# EAGLE schematic Mug Temperature Sensor (EAGLE 5.11)
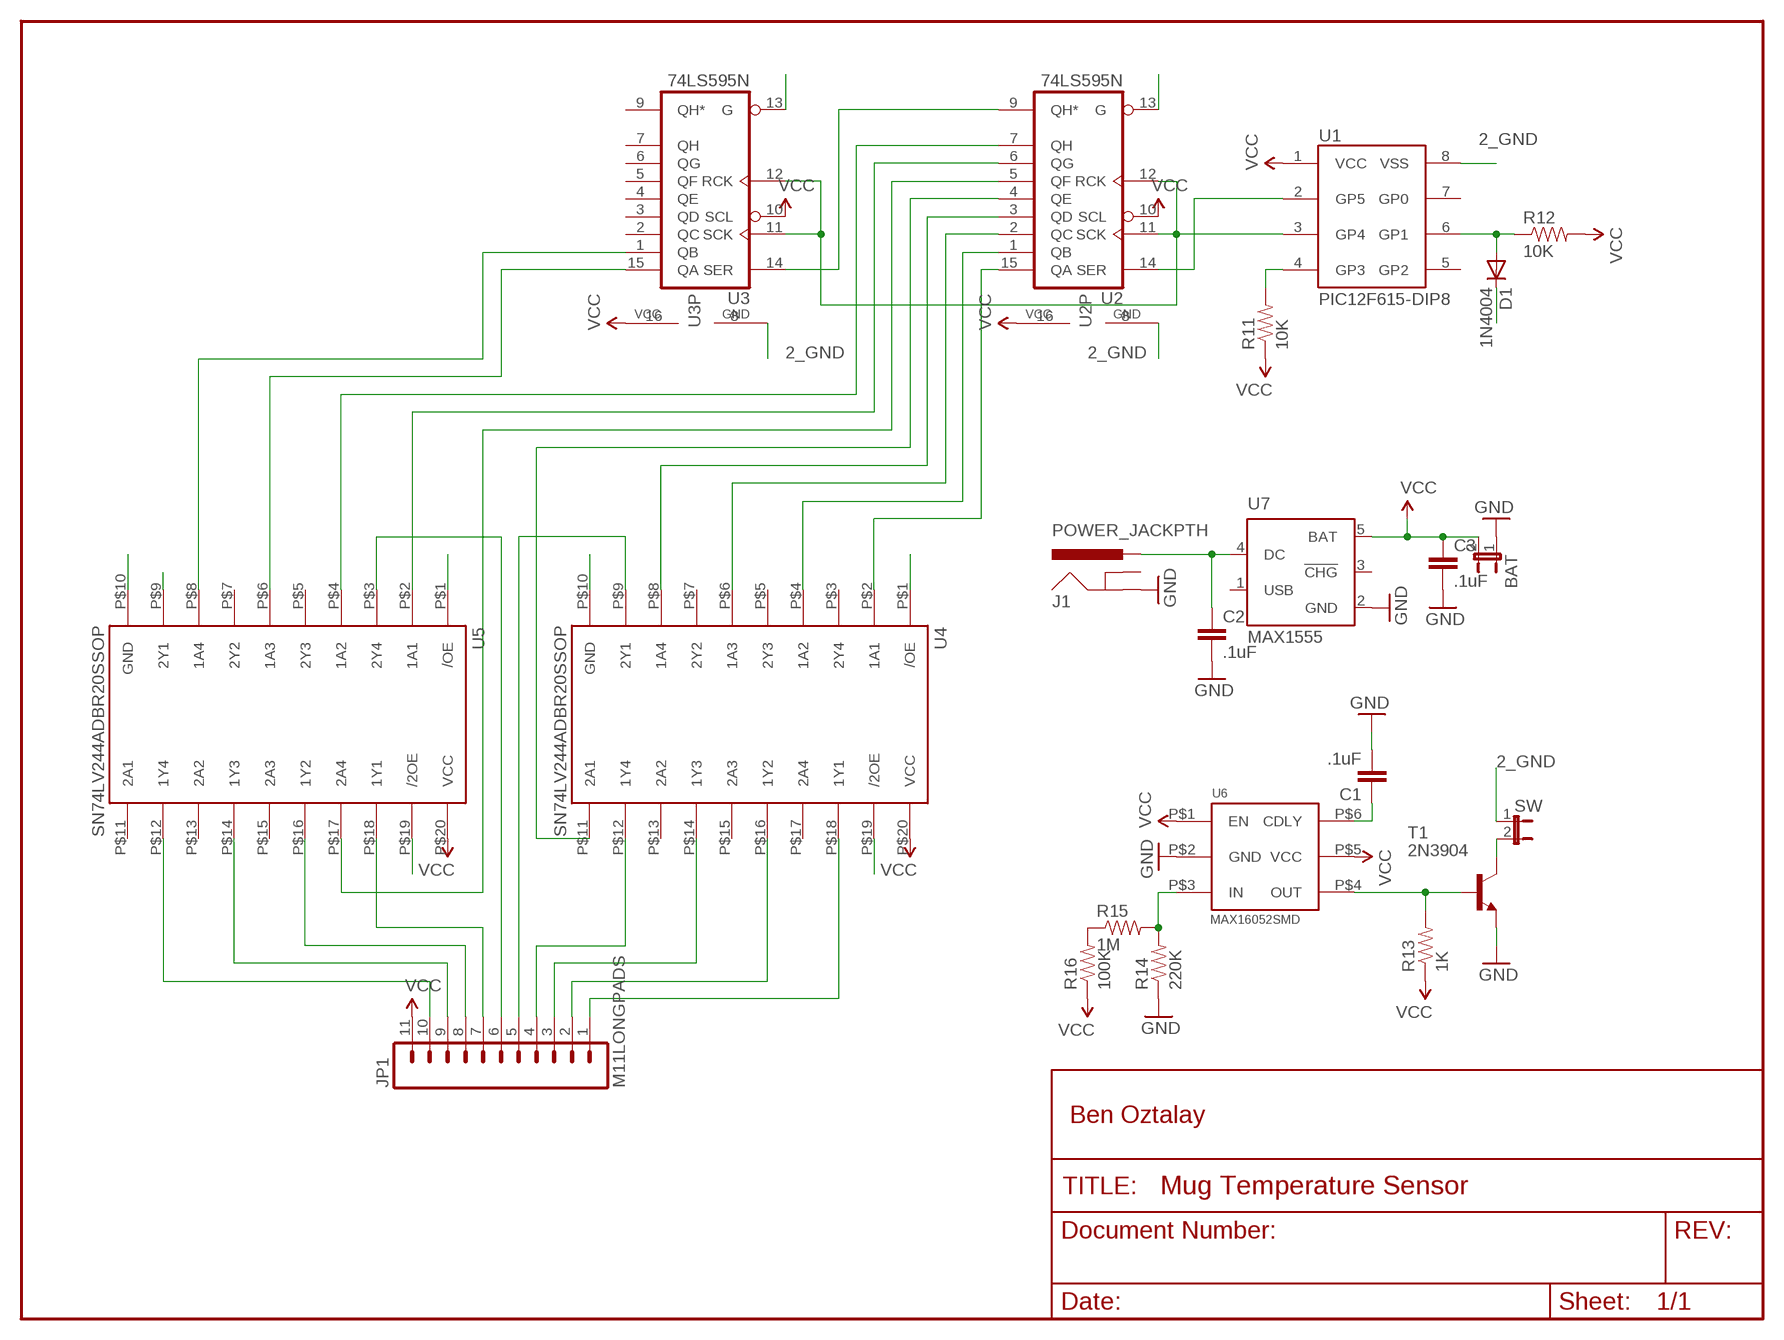
[diagram p0: schematic, sheet 1]

## Parts
BAT  JUMPER-2PTH  [1X02]
C1  .1uF  CAPPTH  [CAP-PTH-SMALL]
C2  .1uF  CAPPTH  [CAP-PTH-SMALL]
C3  .1uF  CAPPTH  [CAP-PTH-SMALL]
D1  1N4004  [DO41-10]
J1  POWER_JACKPTH  [POWER_JACK_PTH]
JP1  M11LONGPADS  [1X11_LONGPADS]
R11  10K  RESISTORPTH-1/4W  [AXIAL-0.4]
R12  10K  RESISTORPTH-1/4W  [AXIAL-0.4]
R13  1K  RESISTORPTH-1/4W  [AXIAL-0.4]
R14  220K  RESISTORPTH-1/4W  [AXIAL-0.4]
R15  1M  RESISTORPTH-1/4W  [AXIAL-0.4]
R16  100K  RESISTORPTH-1/4W  [AXIAL-0.4]
SW  JUMPER-2PTH  [1X02]
T1  2N3904  [TO92]
U1  PIC12F615-DIP8  [DIP-8-300]
U2  74LS595N  [DIL16]
U3  74LS595N  [DIL16]
U4  SN74LV244ADBR20SSOP  [20-SSOP]
U5  SN74LV244ADBR20SSOP  [20-SSOP]
U6  MAX16052SMD  [6-SOT23]
U7  MAX1555  [SOT23-5L]

## Nets
2_GND: D1.C SW.1 U1.8(VSS) U2.8(GND) U2.13(G) U3.8(GND) U3.13(G) U4.P$1(/OE) U4.P$10(GND) U4.P$19(/2OE) U5.P$10(GND) U5.P$19(/2OE)
GND: BAT.1 C1.2 C2.2 C3.2 J1.GND R14.P$1 T1.3(E) U6.P$2(GND) U7.2(GND)
N$1: U1.3(GP4) U2.11(SCK) U2.12(RCK) U3.11(SCK) U3.12(RCK)
N$2: U1.2(GP5) U2.14(SER)
N$3: U2.9(QH*) U3.14(SER)
N$6: JP1.10 U5.P$12(1Y4)
N$7: JP1.9 U5.P$14(1Y3)
N$8: JP1.8 U5.P$16(1Y2)
N$9: U5.P$9(2Y1)
N$10: JP1.7 U5.P$18(1Y1)
N$11: JP1.6 U5.P$3(2Y4)
N$12: U2.5(QF) U5.P$17(2A4)
N$13: U3.15(QA) U5.P$6(1A3)
N$14: U2.6(QG) U5.P$2(1A1)
N$16: U2.4(QE) U4.P$11(2A1)
N$17: U2.2(QC) U4.P$6(1A3)
N$19: U2.15(QA) U4.P$2(1A1)
N$22: U2.7(QH) U5.P$4(1A2)
N$25: U3.1(QB) U5.P$8(1A4)
N$26: JP1.1 U4.P$18(1Y1)
N$27: JP1.2 U4.P$16(1Y2)
N$28: JP1.3 U4.P$14(1Y3)
N$29: JP1.4 U4.P$12(1Y4)
N$30: JP1.5 U4.P$9(2Y1)
N$32: U2.3(QD) U4.P$8(1A4)
N$34: R11.P$2 U1.4(GP3)
N$35: D1.A R12.P$1 U1.6(GP1)
N$36: C2.1 J1.PWR U7.4(DC)
N$37: R13.P$2 T1.2(B) U6.P$4(OUT)
N$38: C1.1 U6.P$6(CDLY)
N$39: R14.P$2 R15.P$2 U6.P$3(IN)
N$40: R15.P$1 R16.P$2
N$41: SW.2 T1.1(C)
N$42: U2.1(QB) U4.P$4(1A2)
VCC: BAT.2 C3.1 JP1.11 R11.P$1 R12.P$2 R13.P$1 R16.P$1 U1.1(VCC) U2.10(SCL) U2.16(VCC) U3.10(SCL) U3.16(VCC) U4.P$20(VCC) U5.P$20(VCC) U6.P$1(EN) U6.P$5(VCC) U7.5(BAT)
Unconnected: J1.GNDBREAK U1.5(GP2) U1.7(GP0) U3.2(QC) U3.3(QD) U3.4(QE) U3.5(QF) U3.6(QG) U3.7(QH) U3.9(QH*) U4.P$3(2Y4) U4.P$5(2Y3) U4.P$7(2Y2) U4.P$13(2A2) U4.P$15(2A3) U4.P$17(2A4) U5.P$1(/OE) U5.P$5(2Y3) U5.P$7(2Y2) U5.P$11(2A1) U5.P$13(2A2) U5.P$15(2A3) U7.1(USB) U7.3(!CHG)

## Notes on the sheet
- Ben Oztalay

## Library data of the parts
BAT SW = SparkFun:JUMPER-2: Jumper Basic 0.1" spaced jumper. Use with breakaway headers.
C1-C3 = SparkFun:CAP: Capacitor Standard 0603 ceramic capacitor, and 0.1" leaded capacitor.
D1 = diode:1N4004: DIODE general purpose rectifier, 1 A
J1 = SparkFun:POWER_JACK: Power Jack This is the standard 5.5mm barrel jack for power. The PTH is the most common, proven, reliable, footprint. All others are experimental. The Slot footprint only works if the mill layer is transmitted to the PCB fab house so be warned. Spark Fun Electronics SKU : PRT-00119. Mating wall wart : TOL-00298 (and others)
JP1 = SparkFun:M11: Header 11 Standard 11-pin 0.1" header. Use with straight break away headers (SKU : PRT-00116), right angle break away headers (PRT-00553), swiss pins (PRT-00743), machine pins (PRT-00117), and female headers (PRT-00115).
R11-R16 = SparkFun:RESISTOR: Resistor Basic schematic elements and footprints for 0603, 1206, and PTH resistors.
T1 = transistor:2N3904: NPN TRANSISTOR
U1 = boztalay_custom:PIC12F615
U2 U3 = 74xx-us:74*595: 8-bit SHIFT REGISTER, output latch
U4 U5 = boztalay_custom:SN74LV244ADBR
U6 = boztalay_custom:MAX16052
U7 = maxim:MAX1555: Dual-Input USB/AC Adapter 1-Cell Li+ Battery Chargers Source: http://www.maxim-ic.com .. MAX1551-MAX1555.pdf; MF: MAXIM; MPN: MAX1555EZK+T; OC_FARNELL: 1628222; OC_NEWARK: 59J2761